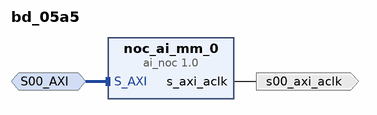
[diagram p0: block diagram of the top level]
# Vivado block design bd_05a5, xcvc1902-vsva2197-2MP-e-S, Vivado 2024.1
create_bd_design bd_05a5

create_bd_intf_port -mode Slave -vlnv xilinx.com:interface:aximm_rtl:1.0 S00_AXI
set_property -dict {CONFIG.ADDR_WIDTH 42 CONFIG.CATEGORY NOC CONFIG.FREQ_HZ 1250000000} [get_bd_intf_ports S00_AXI]
create_bd_port -dir O -type clk s00_axi_aclk
set_property -dict {CONFIG.ASSOCIATED_BUSIF S00_AXI CONFIG.FREQ_HZ 1250000000} [get_bd_ports s00_axi_aclk]

create_bd_cell -type ip -vlnv xilinx.com:ip:ai_noc:1.0 noc_ai_mm_0
set_property -dict [list \
  CONFIG.C_NOC_FREQMHZ 1250 \
  CONFIG.C_NOC_INTF_MODE SLAVE \
  CONFIG.C_NOC_INTF_TYPE AXI4 \
  CONFIG.C_S_AXI_ID_WIDTH 16 \
] [get_bd_cells noc_ai_mm_0]

# ---- connections ----

connect_bd_intf_net [get_bd_intf_pins noc_ai_mm_0/S_AXI] [get_bd_intf_ports S00_AXI]
connect_bd_net [get_bd_pins noc_ai_mm_0/s_axi_aclk] [get_bd_ports s00_axi_aclk]

# ---- address map ----
assign_bd_address -offset 0x20000000000 -range 4G -target_address_space [get_bd_addr_spaces S00_AXI] [get_bd_addr_segs noc_ai_mm_0/S_AXI/Reg]

validate_bd_design
save_bd_design
